# Altium schematic sheet Interface.SchDoc
size A
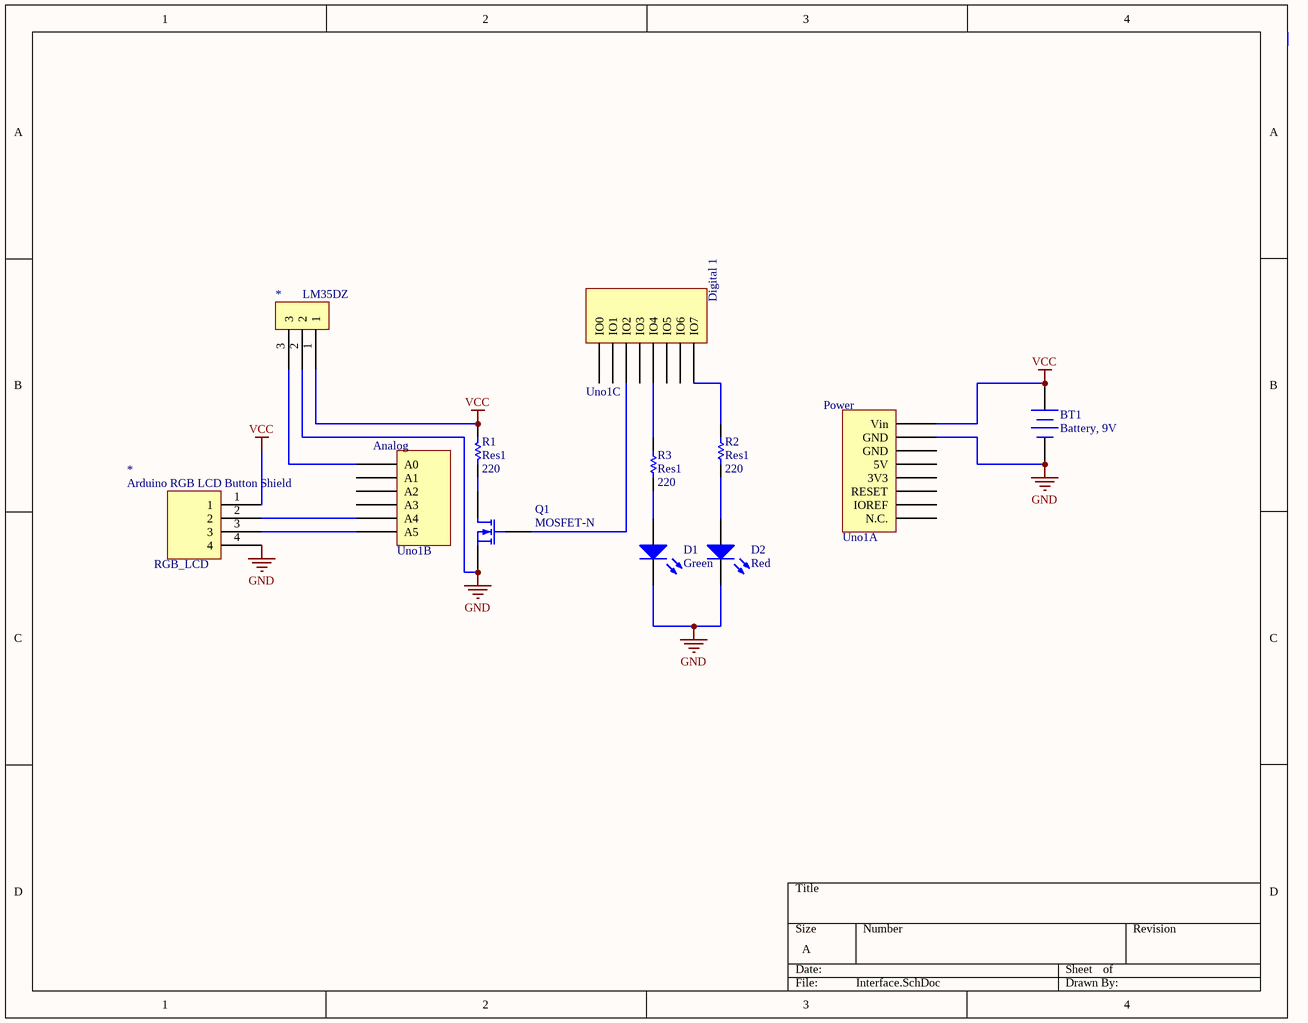
[diagram p0: Interface.SchDoc]

## Parts
(Parts that share a designator on the sheet are numbered #1, #2 ... from top to bottom, then left to right.)
*#1  LM35DZ
*#2  RGB_LCD
BT1  Battery, 9V  [BAT-2]
D1  Green  [LED-0]
D2  Red  [LED-0]
Q1  MOSFET-N  [E3]
R1  Res1  value 220  [AXIAL-0.3]
R2  Res1  value 220  [AXIAL-0.3]
R3  Res1  value 220  [AXIAL-0.3]
Uno1  Arduino Uno  [Arduino Uno Adapter]  (value not drawn)  (parts A,B,C of 5)

## Nets
GND: *#1.2 *#2.4 BT1.2(-) D1.2(K) D2.2(K) Q1.3(S) Uno1.GND2(GND)
VCC: *#1.1 *#2.1 BT1.1(+) R1.1 Uno1.Vin
Net*#1_3: *#1.3 Uno1.A0
Net*#2_2: *#2.2 Uno1.A4
Net*#2_3: *#2.3 Uno1.A5
NetD1_1: D1.1(A) R3.2
NetD2_1: D2.1(A) R2.2
NetQ1_1: Q1.1(D) R1.2
NetQ1_2: Q1.2(G) Uno1.2(IO2)
NetR2_1: R2.1 Uno1.7(IO7)
NetR3_1: R3.1 Uno1.4(IO4)

Not connected (* = marked no-connect by the designer): Uno1 0(IO0) 1(IO1) 3(IO3) 3V3 5(IO5) 5V 6(IO6) A1 A2 A3 GND1(GND) IOREF NC(N.C.) RESET

## Notes on the sheet
- (in symbol Arduino Uno, part A) Power
- (in symbol Arduino Uno, part B) Analog
- (in symbol Arduino Uno, part C) Digital 1
- (in symbol RGB_LCD) Arduino RGB LCD Button Shield

## Library data of the parts
BT1 = Battery: Multicell Battery; Published: 24-Mar-1999; LatestRevisionDate: 17-Jul-2002; LatestRevisionNote: Re-released for DXP Platform.; PackageReference: BAT-2; Publisher: Altium Limited; PackageDescription: Battery; 2 Leads
D1 D2 = LED0: Typical INFRARED GaAs LED; Published: 8-Jun-2000; LatestRevisionDate: 08-Jul-2005; LatestRevisionNote: Mech Layer 1 removed.; PackageReference: LED-0; Publisher: Altium Limited; PackageDescription: LED; 2 Leads
Q1 = MOSFET-N: N-Channel MOSFET; Published: 8-Jun-2000; LatestRevisionDate: 17-Jul-2002; LatestRevisionNote: Re-released for DXP Platform.; PackageVersion: 1995/1996; PackageReference: E3; Publisher: Altium Limited; PackageDescription: TO, Flat Index; 3 In-Line, Axial Leads; Body Dia. 4.6mm; Lead Dia. 0.5 mm (max)
R1-R3 = Res1: Resistor; Published: 8-Jun-2000; LatestRevisionDate: 17-Jul-2002; LatestRevisionNote: Re-released for DXP Platform.; PackageReference: AXIAL-0.3; Publisher: Altium Limited; PackageDescription: Axial Device, Thru-Hole; 2 Leads; 0.3 in Pin Spacing